# EAGLE design 9235HallEffectV1.1 (EAGLE 8.2.2)
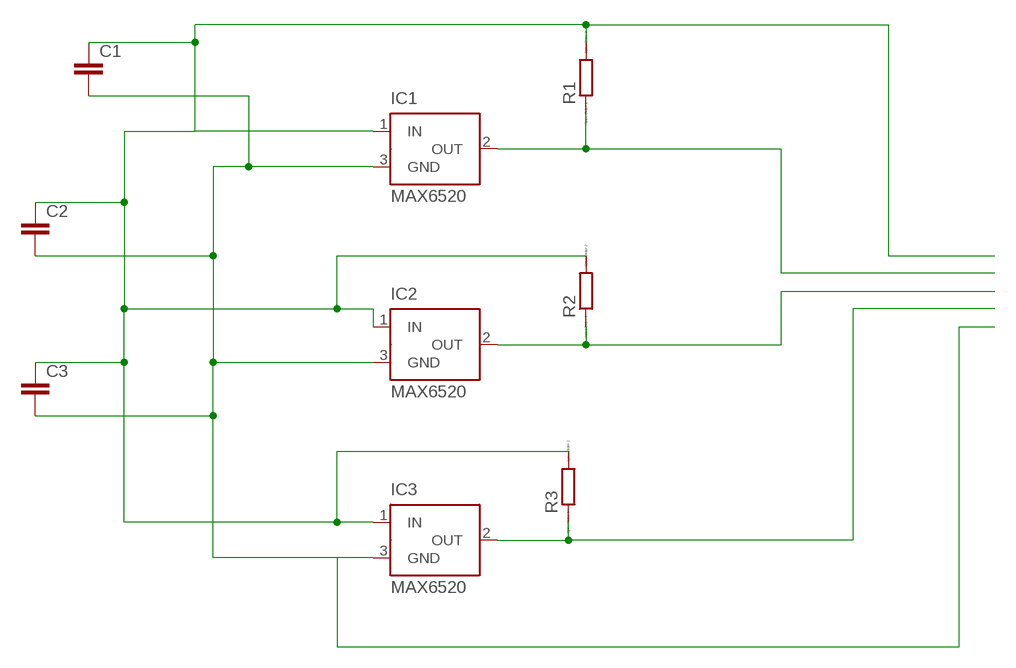
[diagram p0: schematic, sheet 1]

## Parts
C1  C-EUC0603  [C0603]
C2  C-EUC0603  [C0603]
C3  C-EUC0603  [C0603]
IC1  MAX6520  [SOT23]
IC2  MAX6520  [SOT23]
IC3  MAX6520  [SOT23]
R1  RR0603  [R0603]
R2  RR0603  [R0603]
R3  RR0603  [R0603]

## Nets
GND: C1.2 C2.2 C3.2 IC1.3(GND) IC2.3(GND) IC3.3(GND)
H1: IC1.2(OUT) R1.1
H2: IC2.2(OUT) R2.1
H3: IC3.2(OUT) R3.1
VIN: C1.1 C2.1 C3.1 IC1.1(IN) IC2.1(IN) IC3.1(IN) R1.2 R2.2 R3.2

## Library data of the parts
C1-C3 = rcl:C-EU: CAPACITOR, European symbol
IC1-IC3 = maxim:MAX6520: 1.2V Voltage Reference 50ppm/°C, SOT23, 3-Terminal Source: Data sheet <http://datasheets.maxim-ic.com/en/ds/MAX6520.pdf>; MF: MAXIM; MPN: MAX6520EUR-T; OC_FARNELL: unknown; OC_NEWARK: 02J4586
R1-R3 = eagle-ltspice:R: RESISTOR, European symbol; SPICEMODEL: NONE; SPICEPREFIX: R

## Net classes
0 default: width 0.508 mm, clearance 0.508 mm

## Board
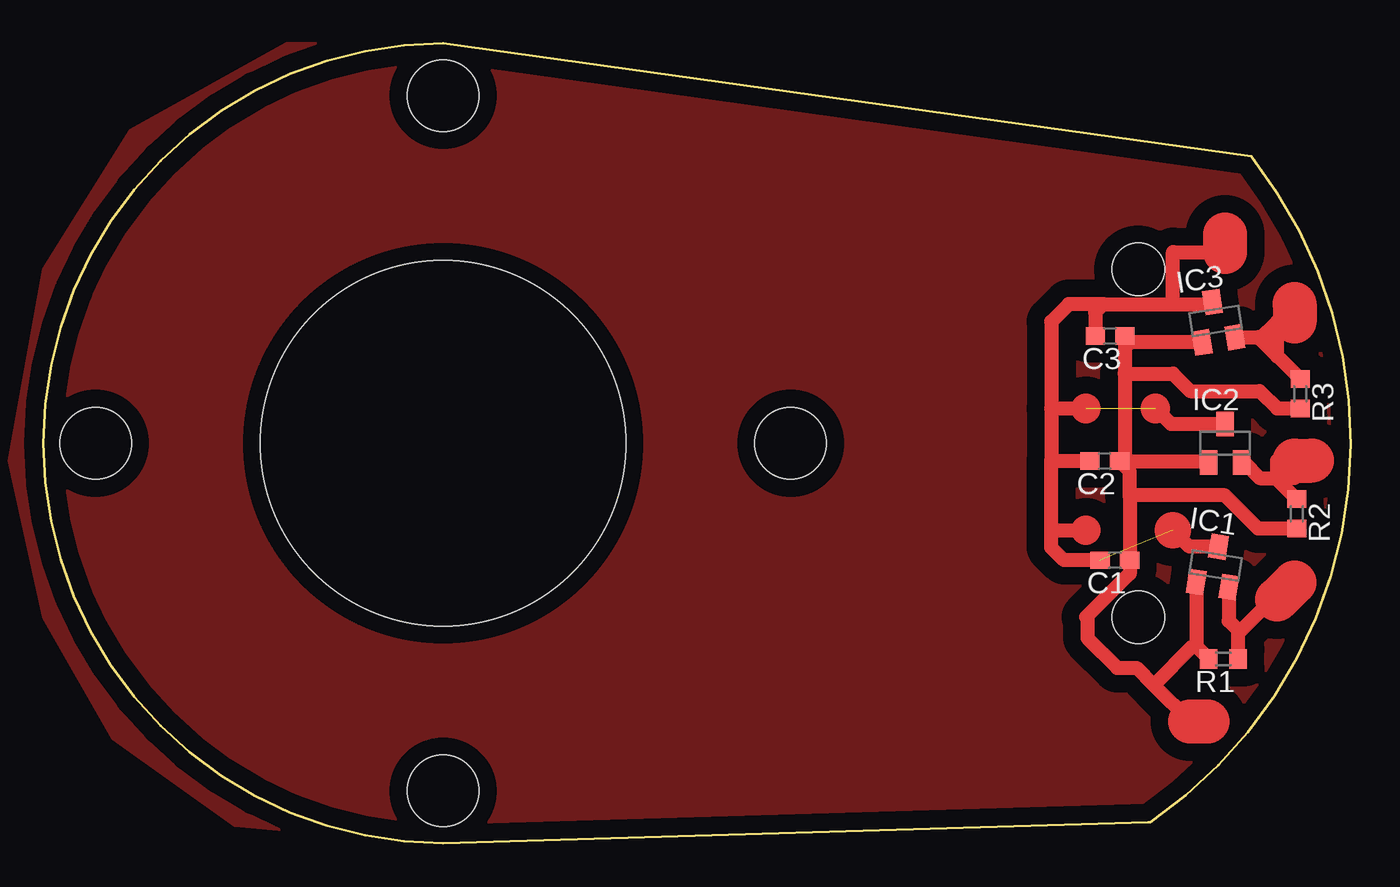
[diagram p1: board, top side]
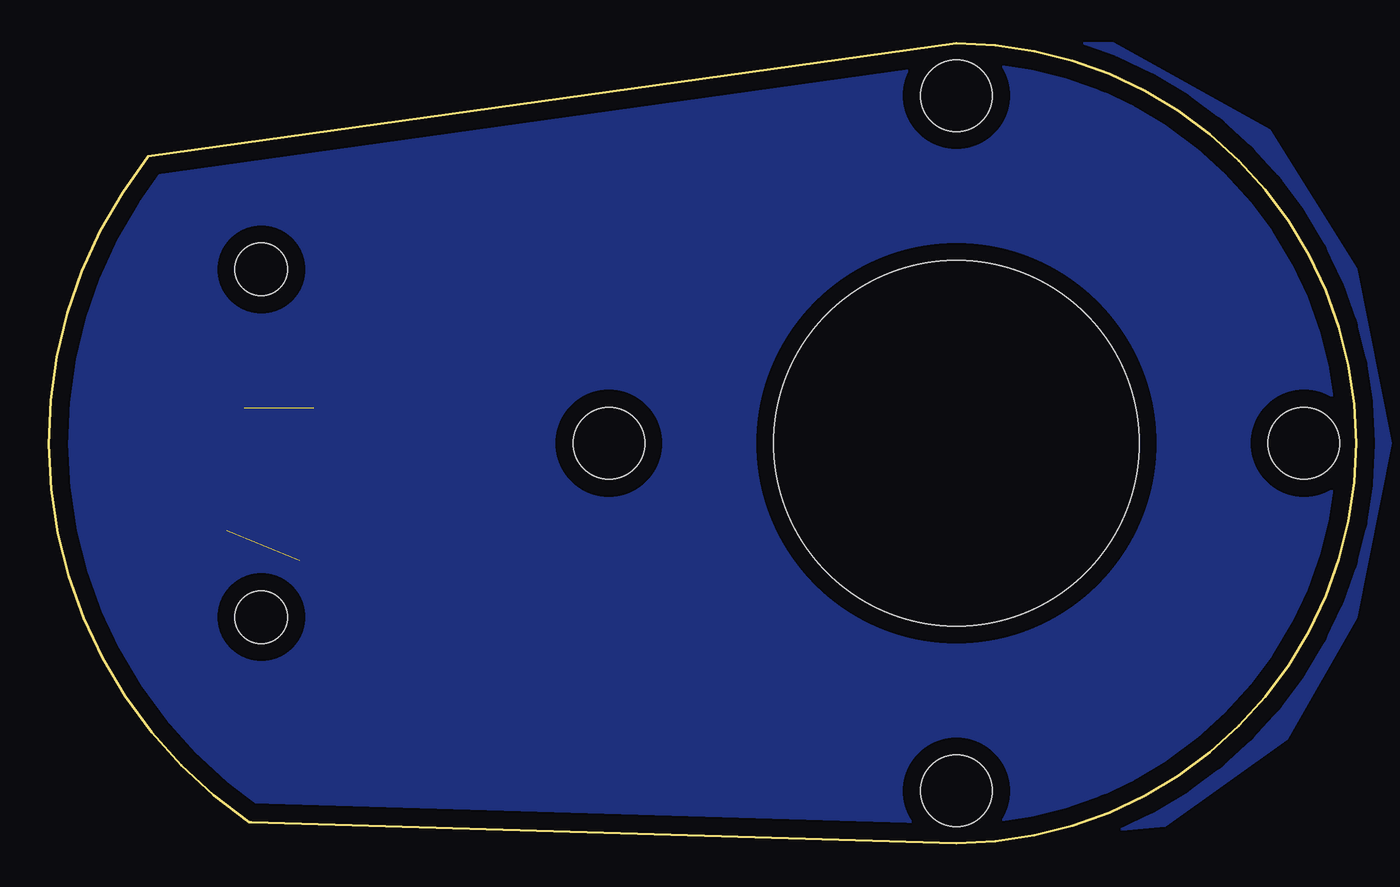
[diagram p2: board, bottom side, seen from below]

Size 75.23 x 46 mm. Coordinates in mm from the lower left corner, seen from the top.
Outline: 69.5,39.5 arc-94 63.7,1.2 63.6,1.2 23,0 arc-180 23,46 69.5,39.5
Copper layers (1*16): Top 0.035mm / dielectric 1.5mm / Bottom 0.035mm
Design rules "default": minimum track width 6mil, minimum drill 0.35mm, track to track 6mil, track to pad 6mil, pad to pad 6mil, via to via 6mil, smd to smd 6mil, copper to edge 40mil, drill to drill 6mil, minimum pad ring 10mil, minimum via ring 8mil, stop-mask expansion 4mil, vias tented up to drill 0mil, thermal gap 10mil
Holes 4.1 mm at 43,23 23,43 3,23 23,3
Holes 21 mm at 23,23
Holes 3 mm at 63,33 63,13

### Footprints (pad centres in the part's own frame; a part is rotated, then mirrored left to right if it is on the bottom)
C0603 = smd 1.1 x 1: 1 -0.85,0; 2 0.85,0
SOT23 = smd 1 x 1.4: 1 -0.95,-1.1; 2 0.95,-1.1; 3 0,1.1
R0603 = smd 1 x 1.1: 1 -0.85,0; 2 0.85,0

### Placement (x,y rotation side)
C1  61.66,16.27 180 top
C2  61.07,21.97 180 top
C3  61.38,29.17 180 top
IC1  67.45,15.96 351 top
IC2  68,23 0 top
IC3  67.45,30.04 9 top
R1  67.91,10.59 180 top
R2  72.13,18.94 270 top
R3  72.33,25.85 270 top

### Tracks (layer width: path | path; a pad name or v marks a point on that pad's centre or on a via)
GND  (2 unrouted)
  Top 0.813: C3.2 60.53,30.53 61,31 | 61,31 65,31 | 65,31 67.15,31 IC3.3 | 61,31 59,31 58,30 58,25 | 58,25 58,22 | 58,22 60.19,22 C2.2 | IC2.3 64.9,24.1 64,25 | 58,25 60,25 | 58,18 58,22 | IC1.3 65.95,17.05 65,18 | 58,18 60,18 | C1.2 58.73,16.27 58,17 58,18 | 65,31 65,34 68,34
  Top 2.54: 68,35 68,34
H1
  Top 0.813: R1.1 68.76,12.24 68.22,12.78 IC1.2
H2
  Top 0.813: IC2.2 69.1,21.9 70,21 70.92,21 R2.1
H3
  Top 0.813: IC3.2 69.93,29.1 R3.1
N$1
  Top 0.813: 71,21 72,22 | 71,21 72,21 71,22 71,21
  Top 2.54: 72,22 73,22
N$2
  Top 0.813: 71,14 70.7,14 68.77,12.07
  Top 2.54: 72,15 71,14
N$3
  pour Bottom (isolate 1): 69,40 75,28 75,17 70,7 64,1 22,0 11,1 4,6 0,13 -2,23 0,33 5,41 14,46 23,46
N$4
  pour Top (isolate 1): 23,46 69,40 75,28 75,17 70,7 64,1 22,0 11,1 4,6 0,13 -2,22 0,33 5,41 14,46
N$5
  Top 2.54: 72,31 72,30
N$7
  Top 0.813: 71,28 71,29 70,29 71,30
VIN
  Top 0.813: IC3.1 62.59,28.8 C3.1 62.23,27 | 62.23,27 62.23,22.28 C2.1 | C2.1 66.98,21.97 IC2.1 | 62.51,19.98 C1.1 62.51,15.49 62.49,15.49 60,13 60.08,12.92 60.08,11.79 61.79,10.08 62.92,10.08 63.91,9.09 | 62.51,19.98 62.51,21.38 C2.1 | R2.2 69.91,18.09 68,20 62.53,20 62.51,19.98 | IC1.1 66.34,11.31 | R1.2 66.34,11.31 | 62.23,27 65,27 66,26 70,26 71,25 R3.2 | 63.91,9.09 66,7 | 66.34,11.31 66.13,11.31 63.91,9.09
  Top 2.54: 66,7 67,7
(copper drawn outside any net)
  shapes: Top circle x4